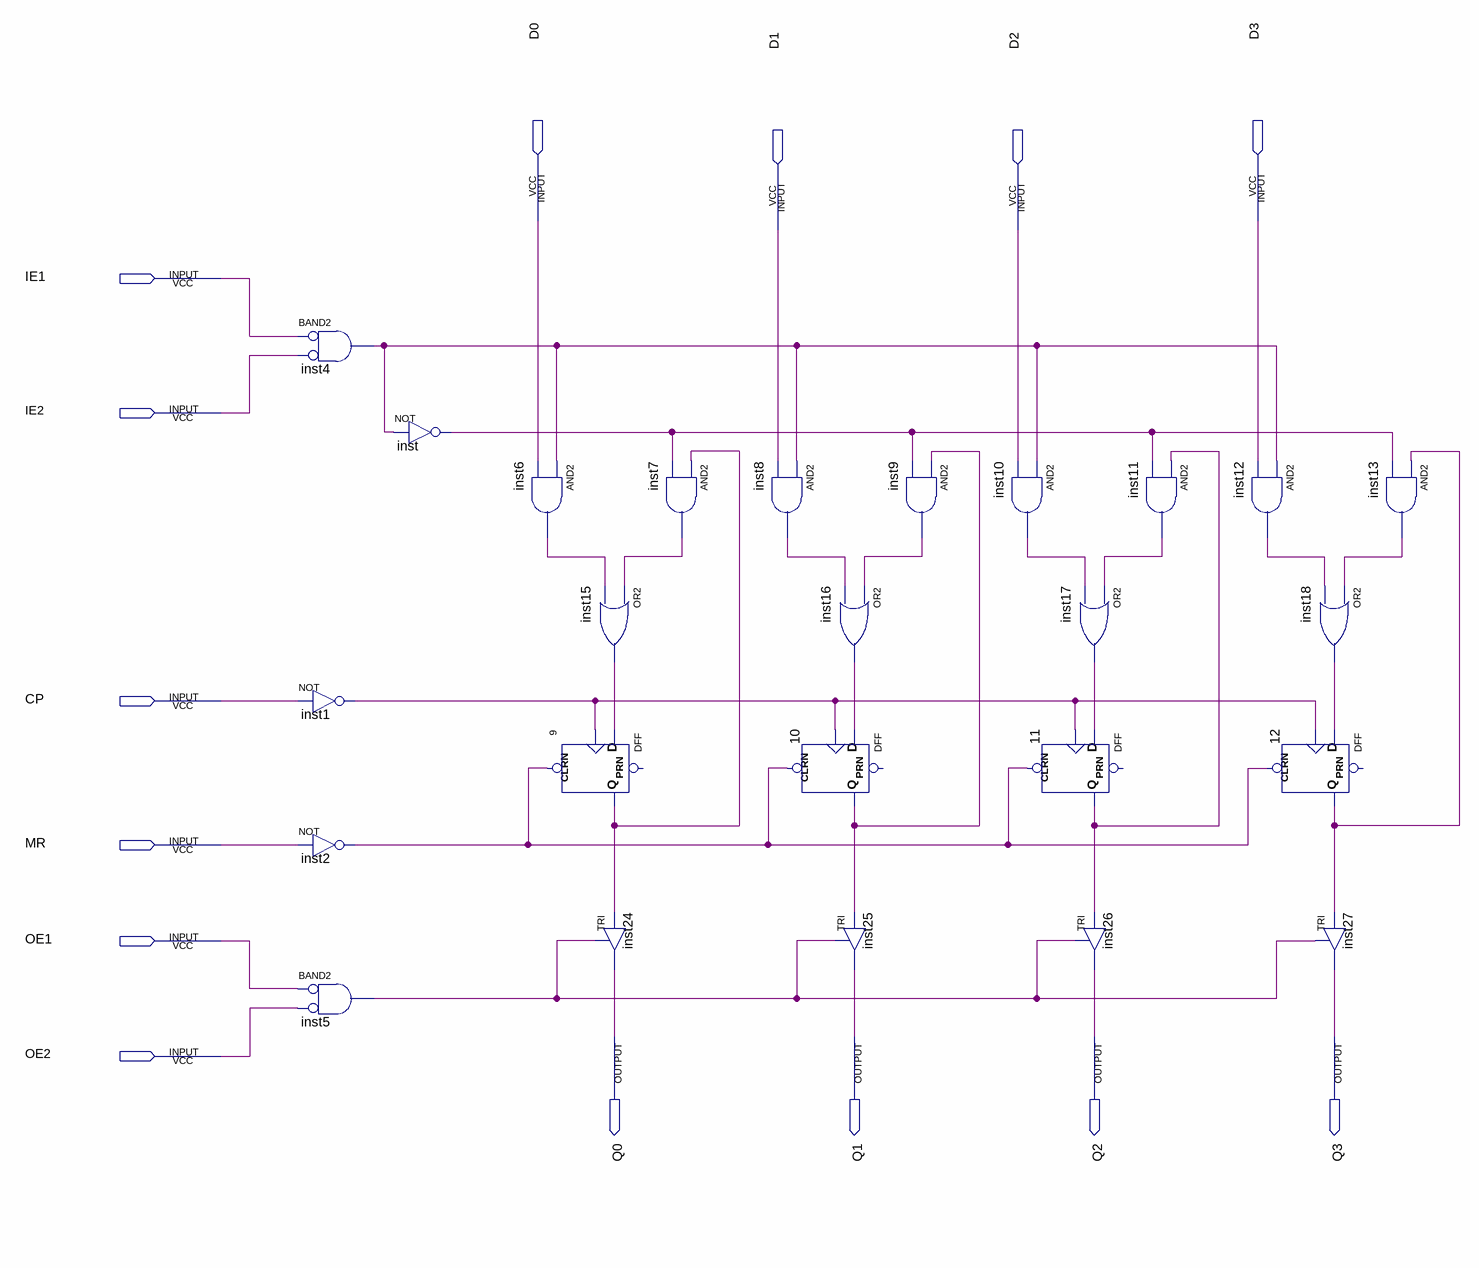
[diagram p0: schematic sheet]
// Quartus schematic 74LS173.bdf as structural Verilog: 25 symbols, 14 pins
module \74LS173  (
  input  D0,
  input  D3,
  input  D1,
  input  D2,
  input  IE1,
  input  IE2,
  input  CP,
  input  MR,
  input  OE1,
  input  OE2,
  output Q0,
  output Q1,
  output Q2,
  output Q3
);

  wire inst1_out, inst2_out, inst4_out, inst5_out, inst6_out, inst7_out, inst8_out, inst9_out, inst10_out,
       inst11_out, inst12_out, inst13_out, inst15_out, inst16_out, inst17_out, inst18_out, inst_out, n9_q,
       n10_q, n11_q, n12_q;

  and inst4 (inst4_out, ~IE1, ~IE2);  // BAND2
  not inst1 (inst1_out, CP);
  not inst2 (inst2_out, MR);
  and inst5 (inst5_out, ~OE1, ~OE2);  // BAND2
  not inst (inst_out, inst4_out);
  and inst6 (inst6_out, inst4_out, D0);
  or inst15 (inst15_out, inst7_out, inst6_out);
  DFF u_9 (.CLRN(inst2_out), .CLK(inst1_out), .D(inst15_out), .Q(n9_q));  // open: PRN
  and inst7 (inst7_out, n9_q, inst_out);
  TRI inst24 (.IN(n9_q), .OE(inst5_out), .OUT(Q0));
  and inst8 (inst8_out, inst4_out, D1);
  DFF u_10 (.CLRN(inst2_out), .CLK(inst1_out), .D(inst16_out), .Q(n10_q));  // open: PRN
  and inst9 (inst9_out, n10_q, inst_out);
  or inst16 (inst16_out, inst9_out, inst8_out);
  TRI inst25 (.IN(n10_q), .OE(inst5_out), .OUT(Q1));
  and inst10 (inst10_out, inst4_out, D2);
  DFF u_11 (.CLRN(inst2_out), .CLK(inst1_out), .D(inst17_out), .Q(n11_q));  // open: PRN
  or inst17 (inst17_out, inst11_out, inst10_out);
  TRI inst26 (.IN(n11_q), .OE(inst5_out), .OUT(Q2));
  and inst11 (inst11_out, n11_q, inst_out);
  and inst12 (inst12_out, inst4_out, D3);
  DFF u_12 (.CLRN(inst2_out), .CLK(inst1_out), .D(inst18_out), .Q(n12_q));  // open: PRN
  or inst18 (inst18_out, inst13_out, inst12_out);
  TRI inst27 (.IN(n12_q), .OE(inst5_out), .OUT(Q3));
  and inst13 (inst13_out, n12_q, inst_out);
endmodule
